# EasyEDA schematic SCH_Amogus-Buzzer_2024-08-13.json
TITLE: Sheet_1; REV: 1.0; Date: 2024-08-11; Sheet: 1/1; Drawn By: parkalex380; Company: Your Company
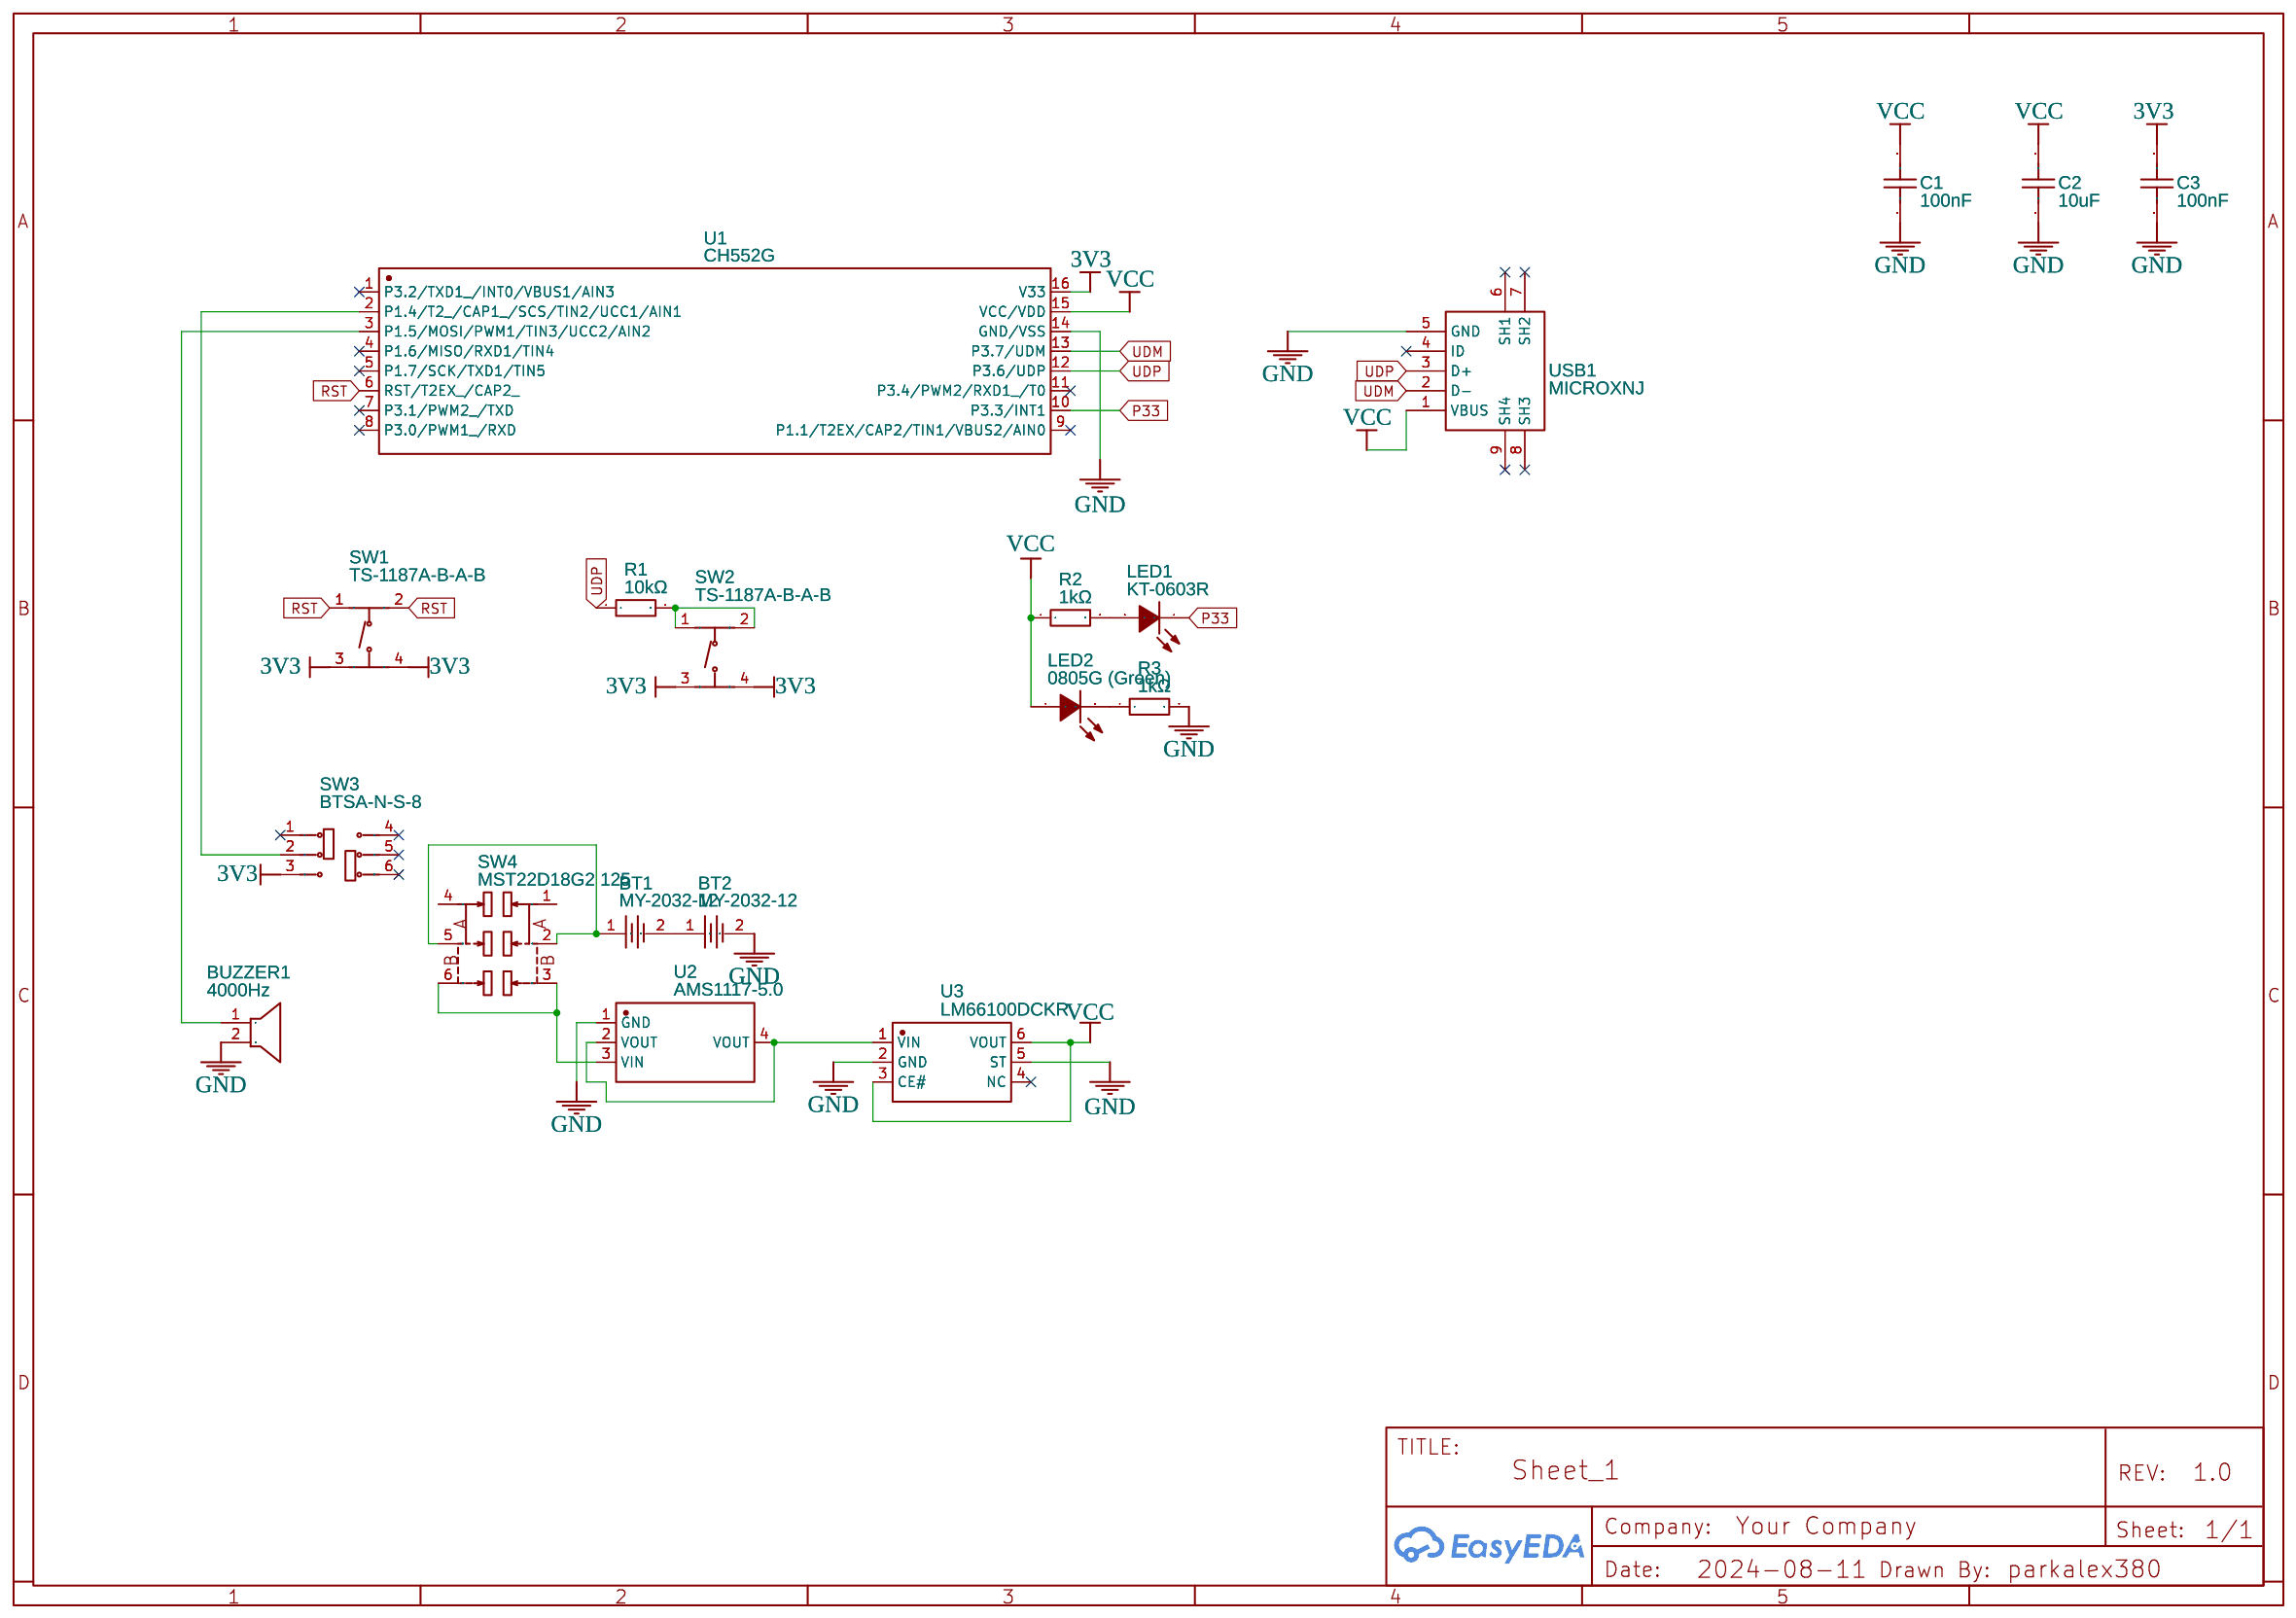
[diagram p0: schematic sheet]

## Parts
BT1  MY-2032-12  [BAT-SMD_MY-2032-12]
BT2  MY-2032-12  [BAT-SMD_MY-2032-12]
BUZZER1  4000Hz  [BUZ-TH_BD12.0-P6.50-D0.8-FD]
C1  100nF  [C0603]
C2  10uF  [C0805]
C3  100nF  [C0603]
LED1  KT-0603R  [LED0603-RD]
LED2  0805G (Green)  [LED0805-R-RD]
R1  10kΩ  [R0603]
R2  1kΩ  [R0603]
R3  1kΩ  [R0603]
SW1  TS-1187A-B-A-B  [SW-SMD_4P-L5.1-W5.1-P3.70-LS6.5-TL-2]
SW2  TS-1187A-B-A-B  [SW-SMD_4P-L5.1-W5.1-P3.70-LS6.5-TL-2]
SW3  BTSA-N-S-8  [SW-SMD_BTSA-N-S-8]
SW4  MST22D18G2 125  [SW-SMD_MST22D18G2]
U1  CH552G  [SOP-16_L10.0-W3.9-P1.27-LS6.0-BL]
U2  AMS1117-5.0  [SOT-223_L6.5-W3.5-P2.30-LS7.0-BR]
U3  LM66100DCKR  [SC-70-6_L2.0-W1.3-P0.65-LS2.1-BL]
USB1  MICROXNJ  [MICRO-USB-SMD_MICROXNJ]

## Library data of the parts
BT1 BT2 = MY-2032-12: Contributor: LCSC; Supplier: LCSC; Supplier Part: C964833; Manufacturer: MYOUNG(美阳); JLCPCB Part Class: Extended Part
BUZZER1 = GPC12075YB-5V: Contributor: LCSC; Supplier: LCSC; Supplier Part: C252948; Manufacturer: INGHAi(赢海); JLCPCB Part Class: Extended Part
C1 C3 = CC0603KRX7R9BB104: Supplier: LCSC; Manufacturer: YAGEO(国巨); Supplier Part: C14663; JLCPCB Part Class: Basic Part
C2 = CL21A106KAYNNNE: Supplier: LCSC; Manufacturer: SAMSUNG(三星); Supplier Part: C15850; JLCPCB Part Class: Basic Part
LED1 = KT-0603R: Supplier: LCSC; Manufacturer: KENTO; Supplier Part: C2286; JLCPCB Part Class: Basic Part
LED2 = 0805G (Green): Supplier: LCSC; Manufacturer: KENTO; Manufacturer Part: KT-0805G; Supplier Part: C2297; JLCPCB Part Class: Basic Part
R1 = 0603WAF1002T5E: Supplier: LCSC; Manufacturer: UNI-ROYAL(厚声); Supplier Part: C25804; JLCPCB Part Class: Basic Part
R2 R3 = 0603WAF1001T5E: Supplier: LCSC; Manufacturer: UNI-ROYAL(厚声); Supplier Part: C21190; JLCPCB Part Class: Basic Part
SW1 SW2 = TS-1187A-B-A-B: Contributor: LCSC; Supplier: LCSC; Supplier Part: C318884; Manufacturer: XKB Connectivity(中国星坤); JLCPCB Part Class: Basic Part
SW3 = BTSA-N-S-8: Contributor: LCSC; Supplier: LCSC; Supplier Part: C2693632; Manufacturer: ROCPU Switches(台普); JLCPCB Part Class: Extended Part
SW4 = MST22D18G2 125: Contributor: LCSC; Supplier: LCSC; Supplier Part: C2906280; Manufacturer: SHOU HAN(首韩); JLCPCB Part Class: Extended Part
U1 = CH552G: Supplier: LCSC; Manufacturer: WCH(南京沁恒); Supplier Part: C111292; JLCPCB Part Class: Extended Part
U2 = AMS1117-5.0: sourceId: HltLFyQwq; Supplier: LCSC; Manufacturer: AMS; Supplier Part: C6187; JLCPCB Part Class: Basic Part
U3 = LM66100DCKR: Contributor: LCSC; Supplier: LCSC; Supplier Part: C2869734; Manufacturer: TI(德州仪器); JLCPCB Part Class: Extended Part
USB1 = MICROXNJ: Contributor: LCSC; Supplier: LCSC; Supplier Part: C404969; Manufacturer: SHOU HAN(首韩); Manufacturer Part: MicroXNJ; JLCPCB Part Class: Extended Part

## Nets
3V3: C3.2 SW1.3(C) SW1.4(D) SW2.3(C) SW2.4(D) SW3.3 U1.16(V33)
GND: BT2.2 BUZZER1.2 C1.1 C2.2 C3.1 R3.2 U1.14(GND/VSS) U2.1(GND) U3.2(GND) U3.5(ST) USB1.5(GND)
VCC: C1.2 C2.1 LED2.1(A) R2.1 U1.15(VCC/VDD) U3.3(CE#) U3.6(VOUT) USB1.1(VBUS)
P33: LED1.1(K) U1.10(P3.3/INT1)
RST: SW1.1(A) SW1.2(B) U1.6(RST/T2EX_/CAP2_)
UDM: U1.13(P3.7/UDM) USB1.2(D-)
UDP: R1.1 U1.12(P3.6/UDP) USB1.3(D+)
Net-(BT1-1): BT1.1 SW4.2 SW4.5
Net-(BT1-2): BT1.2 BT2.1
Net-(BUZZER1-1): BUZZER1.1 U1.3(P1.5/MOSI/PWM1/TIN3/UCC2/AIN2)
Net-(LED1-2): LED1.2(A) R2.2
Net-(LED2-2): LED2.2(K) R3.1
Net-(R1-2): R1.2 SW2.1(A) SW2.2(B)
Net-(SW3-2): SW3.2 U1.2(P1.4/T2_/CAP1_/SCS/TIN2/UCC1/AIN1)
Net-(SW4-3): SW4.3 SW4.6 U2.3(VIN)
Net-(U2-2): U2.2(VOUT) U2.4(VOUT) U3.1(VIN)

Not connected (* = marked no-connect by the designer): SW3 1* 4* 5* 6*; SW4 1 4; U1 1(P3.2/TXD1_/INT0/VBUS1/AIN3)* 4(P1.6/MISO/RXD1/TIN4)* 5(P1.7/SCK/TXD1/TIN5)* 7(P3.1/PWM2_/TXD)* 8(P3.0/PWM1_/RXD)* 9(P1.1/T2EX/CAP2/TIN1/VBUS2/AIN0)* 11(P3.4/PWM2/RXD1_/T0)*; U3 4(NC)*; USB1 4(ID)* 6(SH1)* 7(SH2)* 8(SH3)* 9(SH4)*
